# EAGLE design Conn_pcb6 (EAGLE 9.1.0)
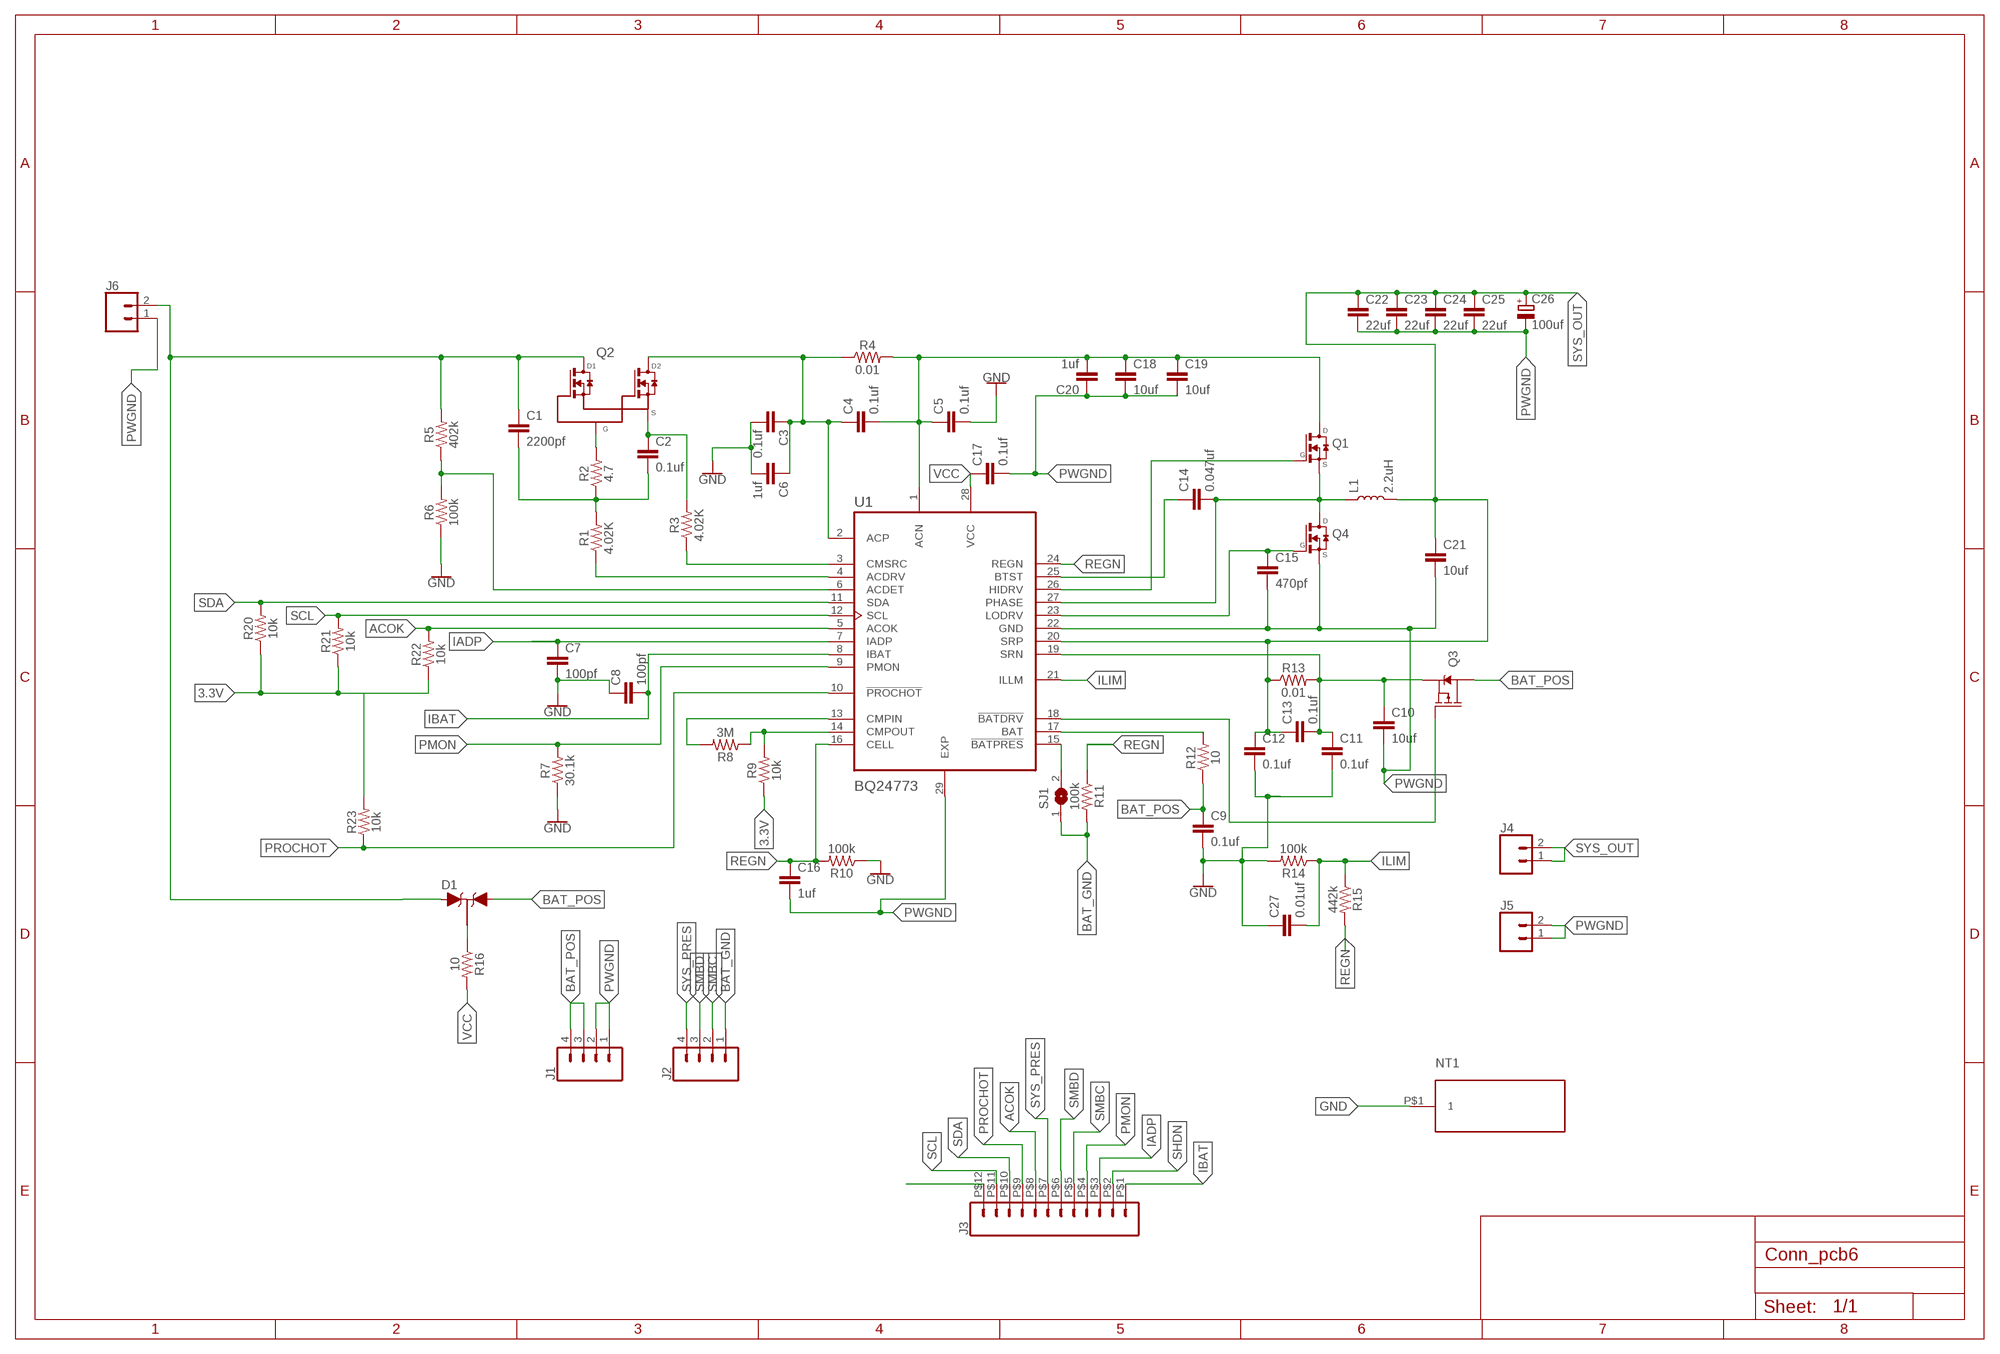
[diagram p0: schematic, sheet 1]

## Parts
C1  2200pf  CAP0402  [CAPC1005X50]
C2  0.1uf  CAP0402  [CAPC1005X50]
C3  0.1uf  CAP0402  [CAPC1005X50]
C4  0.1uf  CAP0402  [CAPC1005X50]
C5  0.1uf  CAP0402  [CAPC1005X50]
C6  1uf  CAP0402  [CAPC1005X50]
C7  100pf  CAP0402  [CAPC1005X50]
C8  100pf  CAP0402  [CAPC1005X50]
C9  0.1uf  CAP0402  [CAPC1005X50]
C10  10uf  C-EUC0805K  [C0805K]
C11  0.1uf  CAP0402  [CAPC1005X50]
C12  0.1uf  CAP0402  [CAPC1005X50]
C13  0.1uf  CAP0402  [CAPC1005X50]
C14  0.047uf  CAP0402  [CAPC1005X50]
C15  470pf  CAP0402  [CAPC1005X50]
C16  1uf  CAP0402  [CAPC1005X50]
C17  0.1uf  CAP0402  [CAPC1005X50]
C18  10uf  C-EUC0805K  [C0805K]
C19  10uf  C-EUC0805K  [C0805K]
C20  1uf  CAP0402  [CAPC1005X50]
C21  10uf  C-EUC0805K  [C0805K]
C22  22uf  C-EUC1206  [C1206]
C23  22uf  C-EUC1206  [C1206]
C24  22uf  C-EUC1206  [C1206]
C25  22uf  C-EUC1206  [C1206]
C26  100uf  EMZR250ARA221MF80G  [CAPAE660X800]
C27  0.01uf  CAP0402  [CAPC1005X50]
D1  BAT54C-7-F  [SOT95P235X110-3]
J1  CONN_041.3  [1X04_NO_SILK_1.3]
J2  CONN_041.3  [1X04_NO_SILK_1.3]
J3  62674-121121ALF  [62674-121121ALF]
J4  CONN_021.4HOLE  [1X02_1.4HOLE]
J5  CONN_021.4HOLE  [1X02_1.4HOLE]
J6  CONN_021.4HOLE  [1X02_1.4HOLE]
L1  2.2uH  XEL6060-222MEB  [RESM6365X610]
NT1  NET_TIE  [NET_TIE]
Q1  CSD17308Q3  [SON65P330X330X110-8]
Q2  CSD87312Q3EVSON  [QFN65P330X330X100-12]
Q3  CSD25402Q3A  [CSD25402Q3A]
Q4  CSD17308Q3  [SON65P330X330X110-8]
R1  4.02K  RES4K04020402  [0402]
R2  4.7  RES4K04020402  [0402]
R3  4.02K  RES4K04020402  [0402]
R4  0.01  SENSE-RES  [1206]
R5  402k  RES4K04020402  [0402]
R6  100k  RES4K04020402  [0402]
R7  30.1k  RES4K04020402  [0402]
R8  3M  RES4K04020402  [0402]
R9  10k  RES4K04020402  [0402]
R10  100k  RES4K04020402  [0402]
R11  100k  RES4K04020402  [0402]
R12  10  RES4K04020402  [0402]
R13  0.01  SENSE-RES  [1206]
R14  100k  RES4K04020402  [0402]
R15  442k  RES4K04020402  [0402]
R16  10  RES4K04020402  [0402]
R20  10k  RES4K04020402  [0402]
R21  10k  RES4K04020402  [0402]
R22  10k  RES4K04020402  [0402]
R23  10k  RES4K04020402  [0402]
SJ1  SJ  [SJ]
U1  BQ24773  [QFN40P400X400X80-29T240]

## Nets
3.3V: R9.1 R20.1 R21.1 R22.1 R23.2
ACOK: J3.P$8 R22.2 U1.5(ACOK)
BAT_GND: J2.1 R11.2 SJ1.1
BAT_POS: C9.1 D1.2(A2) J1.3 J1.4 Q3.1(D) Q3.2(D) Q3.3(D) R12.1
GND: C3.2 C5.2 C6.2 C7.2 C8.1 C9.2 C11.2 C12.2 C27.1 NT1.P$1 R6.1 R7.1 R10.1 R14.2
IADP: C7.1 J3.P$3 U1.7(IADP)
IBAT: C8.2 J3.P$1 U1.8(IBAT)
ILIM: C27.2 R14.1 R15.1 U1.21(ILLM)
N$1: R1.1 U1.4(ACDRV)
N$2: C1.2 C2.2 R1.2 R2.1
N$3: Q2.5(G) R2.2
N$4: C1.1 D1.1(A1) J6.2 Q2.1(D1) Q2.3(D1) Q2.4(D1) R5.2
N$5: R5.1 R6.2 U1.6(ACDET)
N$6: C4.2 C5.1 C18.1 C19.1 C20.2 Q1.5(D) Q1.6(D) Q1.7(D) Q1.8(D) R4.2 U1.1(ACN)
N$7: C2.1 Q2.9(S) Q2.9.1(S) Q2.9.2(S) Q2.9.3(S) Q2.9.4(S) R3.2
N$8: R3.1 U1.3(CMSRC)
N$9: C3.1 C4.1 C6.1 Q2.6(D2) Q2.7(D2) Q2.8(D2) R4.1 U1.2(ACP)
N$10: R8.2 U1.13(CMPIN)
N$11: R8.1 R9.2 U1.14(CMPOUT)
N$12: R12.2 U1.17(BAT)
N$13: Q3.4(G) U1.18(!BATDRV)
N$14: C10.1 C11.1 C13.2 Q3.5(S) Q3.6(S) Q3.7(S) Q3.8(S) Q3.9(S) R13.2 U1.19(SRN)
N$15: C15.1 Q4.4(G) U1.23(LODRV)
N$16: SJ1.2 U1.15(!BATPRES)
N$17: D1.3(K) R16.1
N$18: C14.2 L1.1 Q1.1(S) Q1.2(S) Q1.3(S) Q4.5(D) Q4.6(D) Q4.7(D) Q4.8(D) U1.27(PHASE)
N$19: C14.1 U1.25(BTST)
N$20: Q1.4(G) U1.26(HIDRV)
N$34: J3.P$12
PMON: J3.P$4 R7.2 U1.9(PMON)
PROCHOT: J3.P$9 R23.1 U1.10(!PROCHOT)
PWGND: C10.2 C15.2 C16.2 C17.2 C18.2 C19.2 C20.1 C21.2 C22.2 C23.2 C24.2 C25.2 C26.2(-) J1.1 J1.2 J5.1 J5.2 J6.1 Q4.1(S) Q4.2(S) Q4.3(S) U1.22(GND) U1.29(EXP)
REGN: C16.1 R10.2 R11.1 R15.2 U1.16(CELL) U1.24(REGN)
SCL: J3.P$11 R21.2 U1.12(SCL)
SDA: J3.P$10 R20.2 U1.11(SDA)
SHDN: J3.P$2
SMBC: J2.2 J3.P$5
SMBD: J2.3 J3.P$6
SYS_OUT: C12.1 C13.1 C21.1 C22.1 C23.1 C24.1 C25.1 C26.1(+) J4.1 J4.2 L1.2 R13.1 U1.20(SRP)
SYS_PRES: J2.4 J3.P$7
VCC: C17.1 R16.2 U1.28(VCC)

## Library data of the parts
C1-C9 C11-C17 C20 C27 = BMS:CAP0402
C10 C18 C19 C21-C25 = rcl:C-EU: CAPACITOR, European symbol; SPICEPREFIX: C
C26 = BMS:EMZR250ARA221MF80G
D1 = BMS:BAT54C-7-F
J1 J2 = SparkFun-Connectors:CONN_04: Multi connection point. Often used as Generic Header-pin footprint for 0.1 inch spaced/style header connections On any of the 0.1 inch spaced packages, you can populate with these: Break Away Headers - Straight <https://www.sparkfun.com/products/116> (PRT-00116) Break Away Male Headers - Right Angle <https://www.sparkfun.com/products/553> (PRT-00553) Female Headers <https://www.sparkfun.com/products/115> (PRT-00115) Break Away Headers - Machine Pin <https://www.sparkfun.com/products/117> (PRT-00117) Break Away Female Headers - Swiss Machine Pin <https://www.sparkfun.com/products/743> (PRT-00743) For SCREWTERMINALS and SPRING TERMINALS visit here: Screw Terimnals on SparkFun.com <https://www.sparkfun.com/search/results?term=Screw+Terminals> (5mm/3.5mm/2.54mm spacing) This device is also useful as a general connection point to wire up your design to another part of your project. Our various solder wires solder well into these plated through hole pads. Hook-Up Wire - Assortment (Stranded, 22 AWG) <https://www.sparkfun.com/products/11375> (PRT-11375) Hook-Up Wire - Assortment (Solid Core, 22 AWG) <https://www.sparkfun.com/products/11367> (PRT-11367) View the entire wire category on our website here <https://www.sparkfun.com/categories/141> Special notes: Molex polarized connector foot print use with SKU : PRT-08231 with associated crimp pins and housings. 1MM SMD Version SKU: PRT-10208
J3 = CSD25402Q3A:62674-121121ALF
J4-J6 = SparkFun-Connectors:CONN_02: Multi connection point. Often used as Generic Header-pin footprint for 0.1 inch spaced/style header connections On any of the 0.1 inch spaced packages, you can populate with these: Break Away Headers - Straight <https://www.sparkfun.com/products/116> (PRT-00116) Break Away Male Headers - Right Angle <https://www.sparkfun.com/products/553> (PRT-00553) Female Headers <https://www.sparkfun.com/products/115> (PRT-00115) Break Away Headers - Machine Pin <https://www.sparkfun.com/products/117> (PRT-00117) Break Away Female Headers - Swiss Machine Pin <https://www.sparkfun.com/products/743> (PRT-00743) For SCREWTERMINALS and SPRING TERMINALS visit here: Screw Terimnals on SparkFun.com <https://www.sparkfun.com/search/results?term=Screw+Terminals> (5mm/3.5mm/2.54mm spacing) This device is also useful as a general connection point to wire up your design to another part of your project. Our various solder wires solder well into these plated through hole pads. Hook-Up Wire - Assortment (Stranded, 22 AWG) <https://www.sparkfun.com/products/11375> (PRT-11375) Hook-Up Wire - Assortment (Solid Core, 22 AWG) <https://www.sparkfun.com/products/11367> (PRT-11367) View the entire wire category on our website here <https://www.sparkfun.com/categories/141> Special notes: Molex polarized connector foot print use with: PRT-08233 with associated crimp pins and housings. 2.54_SCREWTERM for use with PRT-10571. 3.5mm Screw Terminal footprints for PRT-08084 5mm Screw Terminal footprints for use with PRT-08432
L1 = BMS:XEL6060-222MEB
NT1 = BMS:NET_TIE
Q1 Q4 = BMS:CSD17308Q3; SPICEPREFIX: Q
Q2 = BMS:CSD87312Q3E
Q3 = CSD25402Q3A:CSD25402Q3A; MANUFACTURER_PART_NUMBER: CSD25402Q3A; VENDOR: Texas Instruments
R1-R3 R5-R12 R14-R16 R20-R23 = BMS:RES4K0402
R4 R13 = BMS:SENSE-RES
SJ1 = jumper:SJ: SMD solder JUMPER
U1 = BMS:BQ24773

## Board
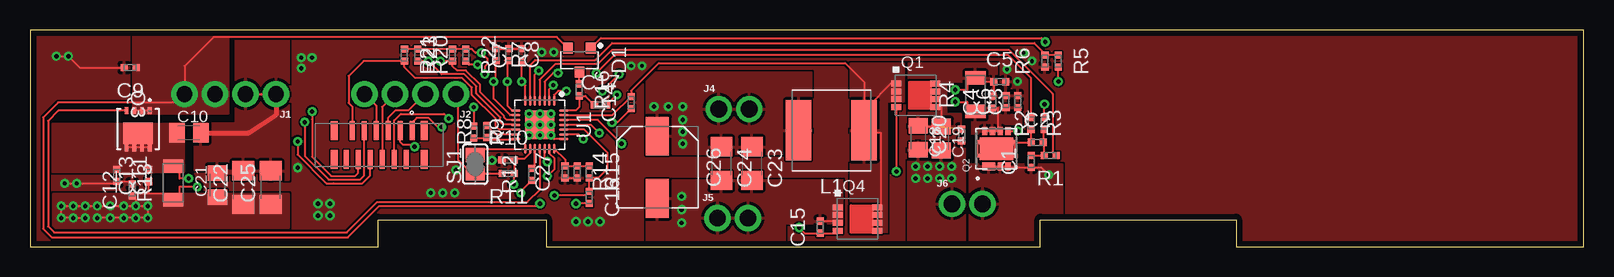
[diagram p1: board, top side]
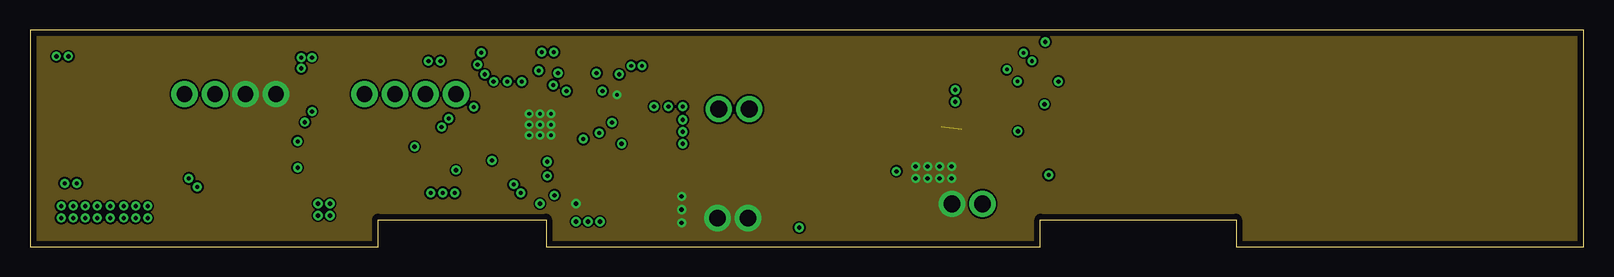
[diagram p2: board, inner layer Route2]
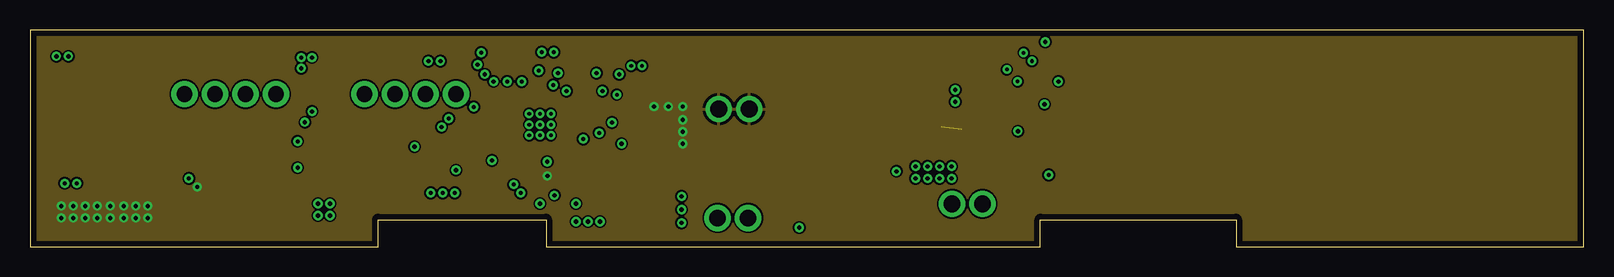
[diagram p3: board, inner layer Route15]
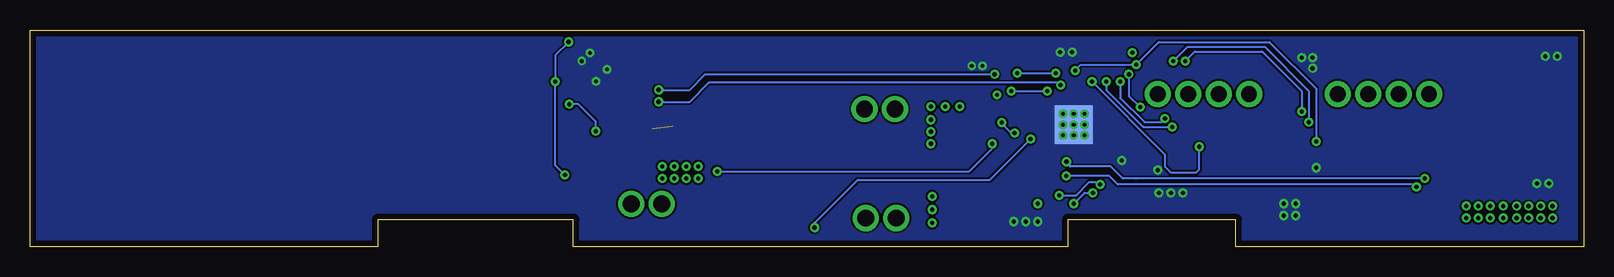
[diagram p4: board, bottom side, seen from below]

Size 129.48 x 18.1 mm. Coordinates in mm from the lower left corner, seen from the top.
Outline: 0,0 29,0 29,2.25 43,2.25 43,0 84.2,0 84.2,2.25 100.5,2.25 100.5,0 129.48,0 129.48,18.1 0,18.1 0,0
Copper layers (1+2*15+16): Top 0.07mm / dielectric 0.15mm / Route2 0.07mm / dielectric 0.3mm / Route15 0.07mm / dielectric 0.15mm / Bottom 0.07mm
Design rules "default *": minimum track width 6mil, minimum drill 0.2mm, track to track 6mil, track to pad 6mil, pad to pad 6mil, via to via 6mil, smd to smd 6mil, copper to edge 20mil, drill to drill 6mil, minimum pad ring 10mil, minimum via ring 8mil, stop-mask expansion 0.07mm, vias tented up to drill 0mil, thermal gap 10mil

### Footprints (pad centres in the part's own frame; a part is rotated, then mirrored left to right if it is on the bottom)
CAPC1005X50 = smd 0.6 x 0.6: 1 -0.5,0; 2 0.5,0
C0805K = smd 1.3 x 1.6: 1 -1,0; 2 1,0
C1206 = smd 1.6 x 1.8: 1 -1.4,0; 2 1.4,0
CAPAE660X800 = smd 3.214 x 1.915: 1 -2.601,0; 2 2.601,0
SOT95P235X110-3 = smd 0.9 x 0.8: 1 -1,0.95; 2 -1,-0.95; 3 1,0
1X04_NO_SILK_1.3 = drill 1.3 pad 2.184: 1 0,0; 2 2.54,0; 3 5.08,0; 4 7.62,0
62674-121121ALF = smd 0.4 x 1.6: P$1 2.75,1.2; P$2 2.25,-1.2; P$3 1.75,1.2; P$4 1.25,-1.2; P$5 0.75,1.2; P$6 0.25,-1.2; P$7 -0.25,1.2; P$8 -0.75,-1.2; P$9 -1.25,1.2; P$10 -1.75,-1.2; P$11 -2.25,1.2; P$12 -2.75,-1.2 | smd 0.6 x 1.6: P$13 -3.75,1.2; P$14 -3.75,-1.2; P$15 3.75,1.2; P$16 3.75,-1.2
1X02_1.4HOLE = drill 1.4 pad 2.184: 1 0,0; 2 2.54,0
RESM6365X610 = smd 2.115 x 5.012: 1 -2.73,0; 2 2.73,0
NET_TIE = smd 3.2 x 3.2: P$1 0,0
SON65P330X330X110-8 = smd 0.5 x 0.83: 1 -0.975,-1.635; 2 -0.325,-1.635; 3 0.325,-1.635; 4 0.975,-1.635; 5 0.975,1.635; 6 0.325,1.635; 7 -0.325,1.635; 8 -0.975,1.635
QFN65P330X330X100-12 = smd 0.65 x 1.09: 1 -1.475,0.65 | smd 0.65 x 0.44: 3 -1.475,-0.325; 4 -1.475,-0.975; 5 1.475,-0.975; 6 1.475,-0.325; 7 1.475,0.325; 8 1.475,0.975 | smd 1.9 x 2.8: 9 0,0 | smd 0.3 x 0.35: 9.1 -0.59,1.575; 9.2 0.59,1.575; 9.3 -0.59,-1.575; 9.4 0.59,-1.575
CSD25402Q3A = smd 0.61 x 0.305: 1 -1.549,0.975; 2 -1.549,0.325; 3 -1.549,-0.325; 4 -1.549,-0.975; 5 1.549,-0.975; 6 1.549,-0.325; 7 1.549,0.325; 8 1.549,0.975 | smd 1.778 x 2.438: 9 0.356,0
0402 = smd 0.6 x 0.6: 1 -0.5,0; 2 0.5,0
1206 = smd 1.131 x 1.67: 1 -1.395,0; 2 1.395,0
SJ = smd 1.168 x 1.6: 1 -0.762,0; 2 0.762,0
QFN40P400X400X80-29T240 = smd 0.8 x 0.2: 1 -2,1.2; 2 -2,0.8; 3 -1.999,0.398; 4 -1.997,0; 5 -2,-0.4; 6 -2,-0.8; 7 -2,-1.2; 15 2,-1.2; 16 2,-0.8; 17 2,-0.4; 18 2,0; 19 2,0.4; 20 2,0.8; 21 2,1.2 | smd 0.2 x 0.8: 8 -1.2,-2; 9 -0.8,-2; 10 -0.4,-2; 11 0,-2; 12 0.4,-2; 13 0.8,-2; 14 1.2,-2; 22 1.2,2; 23 0.8,2; 24 0.4,2; 25 0,2; 26 -0.4,2; 27 -0.8,2; 28 -1.2,2 | smd 2.4 x 2.4: 29 0,0

### Placement (x,y rotation side)
C1  83.43,7.13 90 top
C2  83.94,8.72 0 top
C3  82.3,12.12 90 top
C4  80.23,12.08 90 top
C5  80.8,13.77 0 top
C6  81.33,12.12 90 top
C7  40.98,16.04 90 top
C8  39.9,16.05 270 top
C9  8.36,14.96 180 top
C10  13.24,9.51 0 top
C11  7.23,5.96 270 top
C12  8.52,4.74 90 top
C13  9.87,5.94 90 top
C14  50.1,12.04 90 top
C15  65.85,1.64 90 top
C16  46.6,4.13 270 top
C17  47.54,11.85 0 top
C18  74.02,9.09 270 top
C19  75.93,9.04 270 top
C20  77.63,9.34 90 top
C21  15.62,5.15 90 top
C22  17.77,4.95 90 top
C23  60.16,6.95 270 top
C24  57.61,6.95 270 top
C25  20.06,4.95 90 top
C26  52.28,6.64 270 top
C27  44.59,6.25 90 top
D1  45.78,15.57 270 top
J1  20.5,12.75 180 top
J2  35.5,12.75 180 top
J3  29.1,8.5 0 top
J4  57.4,11.5 0 top
J5  57.3,2.4 0 top
J6  76.84,3.59 0 top
L1  66.78,9.72 180 top
NT1  42.5,10.2 0 bottom
Q1  73.82,12.64 270 top
Q2  80.53,8.18 90 top
Q3  9.01,9.82 270 top
Q4  68.95,2.32 270 top
R1  85.02,7.63 180 top
R2  84.53,10.31 90 top
R3  83.42,10.31 270 top
R4  78.79,12.7 90 top
R5  85.68,15.49 270 top
R6  84.58,15.49 90 top
R7  38.83,16.03 270 top
R8  38.06,9.61 90 top
R9  36.99,9.59 270 top
R10  39.84,7.24 0 top
R11  39.86,6.11 180 top
R12  41.81,6.04 90 top
R13  11.94,5.34 90 top
R14  45.6,6.25 270 top
R15  46.61,6.25 270 top
R16  45.76,13.1 270 top
R20  32.3,16 270 top
R21  31.2,16 270 top
R22  36.3,16 270 top
R23  35.2,16 90 top
SJ1  37.1,6.9 90 top
U1  42.48,10.18 270 top

### Tracks (layer width: path | path; a pad name or v marks a point on that pad's centre or on a via)
3.3V  (via drill 0.35)
  Top 0.152: R21.1 R20.1 R23.2 R22.1 36.81,16.5 37.11,16.2 v37.61,16.2 38.11,15.71 38.11,15.25 37.9,15.04 v37.9,14.4 | v36.97,11.67 36.97,10.11 R9.1
  Bottom 0.152: v37.9,14.4 37.9,12.6 v36.97,11.67
ACOK  (via drill 0.35)
  Top 0.152: U1.5 42.08,14.38 42.39,14.69 v42.39,14.71 | v37.3,15.2 36.6,15.2 R22.2 | v22.3,8.8 22.3,7.7 24.7,5.3 25.3,5.3 27.7,5.3 28.35,5.95 J3.P$8
  Bottom 0.152: v42.39,14.71 41.9,15.2 v37.3,15.2 35.4,17.1 26.2,17.1 22.3,13.2 v22.3,8.8
BAT_GND
  Top 0.152: J2.1 35.7,12.55 35.7,10.2 35.7,7.24 36.8,6.14 SJ1.1 37.27,6.14 37.3,6.11 R11.2
BAT_POS  (via drill 0.35)
  Top 0.152: Q3.1 Q3.2 Q3.3 | D1.2 43.9,17.5 15.3,17.5 12.88,15.08 J1.4 12.18,12.05 2.35,12.05 1.1,10.8 1.1,1.5 1.82,0.78 26.48,0.78 29.1,3.4 42.3,3.4 v42.5,3.6 | v40.9,4.5 40.9,4.63 R12.1
  Bottom 0.152: v42.5,3.6 41.6,4.5 v40.9,4.5
  pour Top (no thermals): 8.6,19.8 16.5,19.8 16.5,11.1 8.6,11.1
GND  (via drill 0.3, 0.35)
  Top 0.152: R7.1 39.88,16.53 C8.1 C7.2 | v2.9,5.3 v3.9,5.3 7.07,5.3 C11.2 8.3,5.46 C12.2 | v2.2,15.9 v3.2,15.9 4.14,14.96 C9.2 | C27.1 R14.2
  other vias: 82.3,13.8 81.4,14.8 82.8,16.2 83.5,15.5 51,15.1 50.1,15.1 38.5,7.2 33.4,4.5 34.4,4.5 35.4,4.5 45.5,2.1 46.5,2.1 47.5,2.1 24,3.6 25,3.6 24,2.6 25,2.6 22.3,6.6 22.6,15.8 23.5,15.8 22.6,14.9 35.5,6.4 42.64,16.24 43.64,16.24
  pour Top (rank 6): -7.1,22.2 -7.1,-8.1 138.3,-8.1 138.3,22.2
  pour Bottom (rank 4): -9.4,28.5 -9.4,-1.5 134,-1.5 134,28.5
  pour Bottom (no thermals): 40.3,12.2 44.7,12.2 44.7,8.1 40.2,8.1 40.2,12.2
IADP  (via drill 0.35)
  Top 0.152: U1.7 41.28,13.48 v40.98,13.78 40.98,15.44 40.88,15.54 C7.1 | v32.05,8.35 31.9,8.5 31.1,8.5 30.85,8.75 J3.P$3
  Bottom 0.152: v40.98,13.78 34.9,7.7 34.9,6.7 34.4,6.2 32.3,6.2 32.05,6.45 32.05,6.65 v32.05,8.35
IBAT  (via drill 0.35)
  Top 0.152: U1.8 40.18,11.38 39.78,11.78 v39.78,13.8 39.78,15.37 39.6,15.55 C8.2 | v34.3,10 33.97,10 33.22,10.75 32.21,10.75 31.85,10.39 J3.P$1
  Bottom 0.152: v39.78,13.8 39.78,13.08 36.7,10 v34.3,10
ILIM
  Top 0.152: U1.21 44.59,7.27 C27.2 R14.1 R15.1
N$1
  Top 0.152: U1.4 42.47,13.94 43.78,15.25 47.3,15.25 48.5,16.45 81.55,16.45 85.22,12.78 85.22,7.93 R1.1
N$2
  Top 0.152: C1.2 R1.2 84.52,8.64 C2.2 84.44,9.72 R2.1
N$3  (via drill 0.35)
  Top 0.152: Q2.5 82.28,9.65 v82.33,9.65 | R2.2 v84.53,11.89 v84.54,11.9
  Bottom 0.152: v82.33,9.65 82.33,10.45 83.78,11.9 v84.54,11.9
N$4  (via drill 0.35)
  Top 0.152: Q2.1 Q2.3 Q2.4 81.58,6.63 C1.1 84.27,6.63 v84.9,6 | D1.1 47.58,17.42 84.28,17.42 v84.6,17.1 | v85.7,13.8 85.7,14.97 R5.2
  Bottom 0.152: v84.9,6 85.7,6.8 v85.7,13.8 85.7,16 v84.6,17.1
  pour Top: 78.3,6.9 86,6.9 86,-0.4 78.3,-0.4
N$5
  Top 0.152: U1.6 41.68,15.18 42.1,15.6 47.1,15.6 48.51,17 83.7,17 84.58,16.12 R6.2 R5.1
N$6  (via drill 0.35)  (1 unrouted)
  Top 0.152: C4.2 80.3,12.58 C5.1 78.79,13.77 R4.2 78.49,14.1 78.09,13.69 78.09,13.3 78.09,13.1 v77.1,13.1 | 77.63,9.94 C20.2 | Q1.5 75.93,11.66 C19.1 74.07,10.04 C18.1 | v44.7,13 44,13 43.68,12.68 U1.1 | v49.1,14.4 v47.7,13
  Bottom 0.152: v47.7,13 v44.7,13 | v77.1,13.1 74.5,13.1 73.2,14.4 v49.1,14.4
  pour Top: 73.2,15.3 73.2,9.6 77.6,9.6 77.6,11.1 76.4,11.1 76.4,13.8 77.4,13.8 80,13.8 80,12.3 80.6,12.3 80.6,15.3
N$7
  Top 0.152: Q2.9.3 Q2.9.4 82.11,8.72 82.1,8.72 | Q2.9.1 Q2.9.2 79.55,8.18 Q2.9 81.56,8.18 82.1,8.72 | 82.1,8.72 C2.1 83.44,9.79 R3.2
N$8  (via drill 0.35)
  Top 0.152: R3.1 83.42,14.08 81.5,16 48.7,16 v47.2,14.5 | U1.3 42.88,13.78 43.6,14.5 v44,14.5
  Bottom 0.152: v47.2,14.5 v44,14.5
N$9  (via drill 0.35)
  Top 0.152: Q2.8 Q2.7 Q2.6 80.86,9.76 80.66,9.96 80.66,11.58 C4.1 80.23,11.31 R4.1 78.29,11.31 78.09,11.51 78.09,12.1 v77.1,12.1 | U1.2 43.28,13.18 v43.6,13.5
  Bottom 0.152: v77.1,12.1 74.51,12.1 72.91,13.7 43.9,13.7 43.7,13.5 v43.6,13.5
  pour Top: 81,9.4 78.5,9.4 78.5,11.8 81,11.8 82.6,11.8 82.6,10.2 81,10.2
N$10
  Top 0.152: U1.13 38.79,9.38 R8.2
N$11
  Top 0.152: U1.14 38.2,8.97 R8.1 38.04,9.09 R9.2
N$12
  Top 0.152: R12.2 42.08,6.81 U1.17
N$13
  Top 0.152: Q3.4 2.37,11.37 1.5,10.5 1.5,1.7 2,1.2 26.4,1.2 28.94,3.74 30.2,3.74 41.44,3.74 42.5,4.8 42.5,8.16 U1.18
N$14  (via drill 0.35)
  Top 0.152: Q3.8 Q3.7 Q3.6 Q3.5 | v43.11,7.1 42.88,7.33 U1.19 | v13.24,5.7 12.44,5.7 12.44,6.43 12.14,6.73 R13.2
  Bottom 0.152: v13.24,5.7 37.3,5.7 38.4,5.7 39.4,6.7 42.8,6.7 43.11,7.01 v43.11,7.1
  pour Top (no thermals): 1.9,10.3 12.8,10.3 12.8,6.2 1.9,6.2
N$15  (via drill 0.35)
  Top 0.152: C15.1 65.9,1.14 | 65.9,1.14 67.31,1.14 Q4.4 | v46.1,9 45.72,9.38 U1.23 | v64.1,1.6 64.56,1.14 65.9,1.14
  Bottom 0.152: v46.1,9 46.6,8.5 49.5,5.6 60.5,5.6 64.1,2 v64.1,1.6
N$16
  Top 0.152: U1.15 37.62,8.18 SJ1.2
N$17
  Top 0.152: R16.1 45.78,13.62 D1.3
N$18
  Top 0.152: Q4.5 Q4.6 Q4.7 70.89,2.65 70.89,9.52 69.59,9.52 69.59,11.47 71.98,13.87 71.98,12.37 72.14,12.37 Q1.3 | L1.1 69.51,13.76 67.93,15.34 52.42,15.34 50.1,13.02 C14.2 48.54,10.98 U1.27
  pour Top: 68.4,15.32 72.8,15.32 72.8,12.1 71.4,12.1 71.4,1.2 68.4,1.2
N$19  (via drill 0.35)
  Top 0.152: C14.1 48.96,10.4 48.5,10.4 v48.5,10.37 | v47.44,9.51 46.76,10.18 U1.25
  Bottom 0.152: v48.5,10.37 48.5,10.3 47.7,9.5 47.69,9.51 v47.44,9.51
N$20  (via drill 0.35)
  Top 0.152: v49.3,8.6 47.32,10.58 U1.26 | Q1.4 72.19,6.32 v72.2,6.3
  Bottom 0.152: v72.2,6.3 51.2,6.3 49.3,8.2 v49.3,8.6
PMON  (via drill 0.35)
  Top 0.152: U1.9 40.02,10.98 38.63,12.37 v38.63,13.8 | R7.2 38.83,14 v38.63,13.8 | v38.63,13.8 | J3.P$4 30.35,10.55 30.9,11.1 34.51,11.1 v34.9,10.71
  Bottom 0.152: v38.63,13.8 38.63,12.43 36.6,10.4 35.9,10.4 35.2,10.4 v34.9,10.7 v34.9,10.71
PROCHOT  (via drill 0.35)
  Top 0.152: U1.10 39.72,10.58 39.51,10.79 39.51,10.93 37.51,12.93 37.51,13.53 36.32,14.71 35.59,14.71 35.2,15.1 R23.1 v34.2,15.5 | v22.91,10.4 22.91,7.59 24.89,5.61 27.5,5.61 27.85,5.96 J3.P$9
  Bottom 0.152: v34.2,15.5 33.01,16.7 26.6,16.7 22.9,12.99 v22.9,10.4 v22.91,10.4
PWGND  (via drill 0.3, 0.35)
  Top 0.152: C15.2 67.31,2.14 Q4.3 | C18.2 75.93,8.09 C19.2 | J1.2 J1.1 | C16.2 45.53,3.63 v45.5,3.6 | U1.22 43.68,8.98 U1.29 v42.5,10.2 | C17.2 v48.9,12.7
  Top 0.406: C10.2 18.21,9.51 20.5,11.01 J1.1
  other vias: 41.6,11.1 41.6,10.2 42.5,11.1 43.4,11.1 43.4,10.2 41.6,9.3 42.5,9.3 43.4,9.3 73.8,6.7 74.8,6.7 75.8,6.7 76.8,6.7 74.8,5.7 73.8,5.7 75.8,5.7 76.8,5.7 54.3,2 54.3,4.2 54.3,3.1
  pour Route2 (no thermals): -8.6,24 135.8,24 135.8,-6.2 -8.6,-6.2
  pour Top: 51.4,5.6 67.7,5.6 67.7,1.9 62.9,1.9 62.9,-0.5 51.4,-0.5 51.4,-0.2 51.4,1.8 51.4,2.2
  pour Top: 17.1,19.8 17.1,10.3 13.7,10.3 13.7,6.4 13.9,6.4 14.9,6.4 14.9,5.6 21.6,5.6 21.6,19.8
  pour Top: 73.2,8.8 77.9,8.8 77.9,-0.4 73.2,-0.4
REGN  (via drill 0.35)
  Top 0.152: U1.24 44.51,9.81 46.16,9.81 48.09,7.88 48.09,6.5 47.34,5.75 R15.2 C16.1 46.27,4.3 v43.7,4.3 | U1.16 41.68,7.81 41.22,7.35 40.45,7.35 R10.2 40.34,6.13 | 40.34,6.13 R11.1 | 40.34,6.13 40.34,5.22 v40.31,5.19
  Bottom 0.152: v43.7,4.3 42.3,4.3 41.2,5.4 40.4,5.4 40.31,5.31 v40.31,5.19
SCL
  Top 0.152: U1.12 39.12,9.78 38.8,10.1 38.8,10.7 36.82,12.68 36.82,13.3 36.02,14.1 32.1,14.1 31.2,15 R21.2 27.8,15.5 26.56,14.26 26.56,12 26.85,11.71 J3.P$11
SDA  (via drill 0.35)
  Top 0.152: U1.11 40.46,10.2 39.4,10.2 39.2,10.4 39.2,10.8 37.2,12.8 37.2,13.4 36.2,14.4 34.3,14.4 v33.2,15.5 R20.2 | v23.51,11.3 23.51,10.66 23.51,10.65 23.51,7.5 25.1,5.91 27.1,5.91 27.35,6.16 J3.P$10
  Bottom 0.152: v33.2,15.5 32.41,16.29 26.8,16.29 23.5,12.99 v23.5,11.3 v23.51,11.3
SHDN
  Top 0.152: 31.3,7.25 J3.P$2
SMBC
  Top 0.152: J2.2 32.9,12.75 31.55,11.4 30.47,11.4 29.84,10.78 J3.P$5
SMBD
  Top 0.152: J2.3 29.35,11.68 J3.P$6
SYS_OUT  (via drill 0.35)
  Top 0.152: 9.9,4.45 8.73,4.45 C12.1 8.8,3.96 v8.8,3.4 | 9.9,4.45 11.44,4.45 R13.1 12.44,4.45 12.44,5 v13.94,5 | U1.20 43.28,7.79 43.71,7.35 43.71,6.5 v43.12,5.91 | C13.1 9.87,4.48 9.9,4.45 | v4.6,2.4 v3.6,2.4 v2.6,2.4 v2.6,3.4 v3.6,3.4 v4.6,3.4 v5.6,3.4 v6.7,3.4 v7.8,3.4 v8.8,3.4 | v8.8,3.4 v9.8,3.4 v9.8,2.4 v8.8,2.4 v7.8,2.4 v6.7,2.4 v5.6,2.4
  Bottom 0.152: v43.12,5.91 v43.11,5.9 39.53,5.9 38.83,5.2 14.14,5.2 v13.94,5
  other vias: 52,11.7 54.4,11.7 53.2,11.7 54.4,8.6 54.4,9.6 54.4,10.6
  pour Top (no thermals): 21.6,4.4 1.9,4.4 1.9,1.8 2.1,1.6 21.6,1.6
  pour Route15 (rank 2): -11.9,26.9 134.9,26.9 134.9,-6.2 -11.9,-6.2
  pour Top: 51.4,14.6 65.1,14.6 65.1,7.7 51.4,7.7
SYS_PRES
  Top 0.152: J2.4 28.85,11.78 J3.P$7
VCC
  Top 0.152: U1.28 45.48,11.38 45.76,11.66 R16.2 46.29,12.6 C17.1